# EAGLE design Smarttree_CMU_5.2.3 (EAGLE 7.7.0)

## Sheet 1 of 2
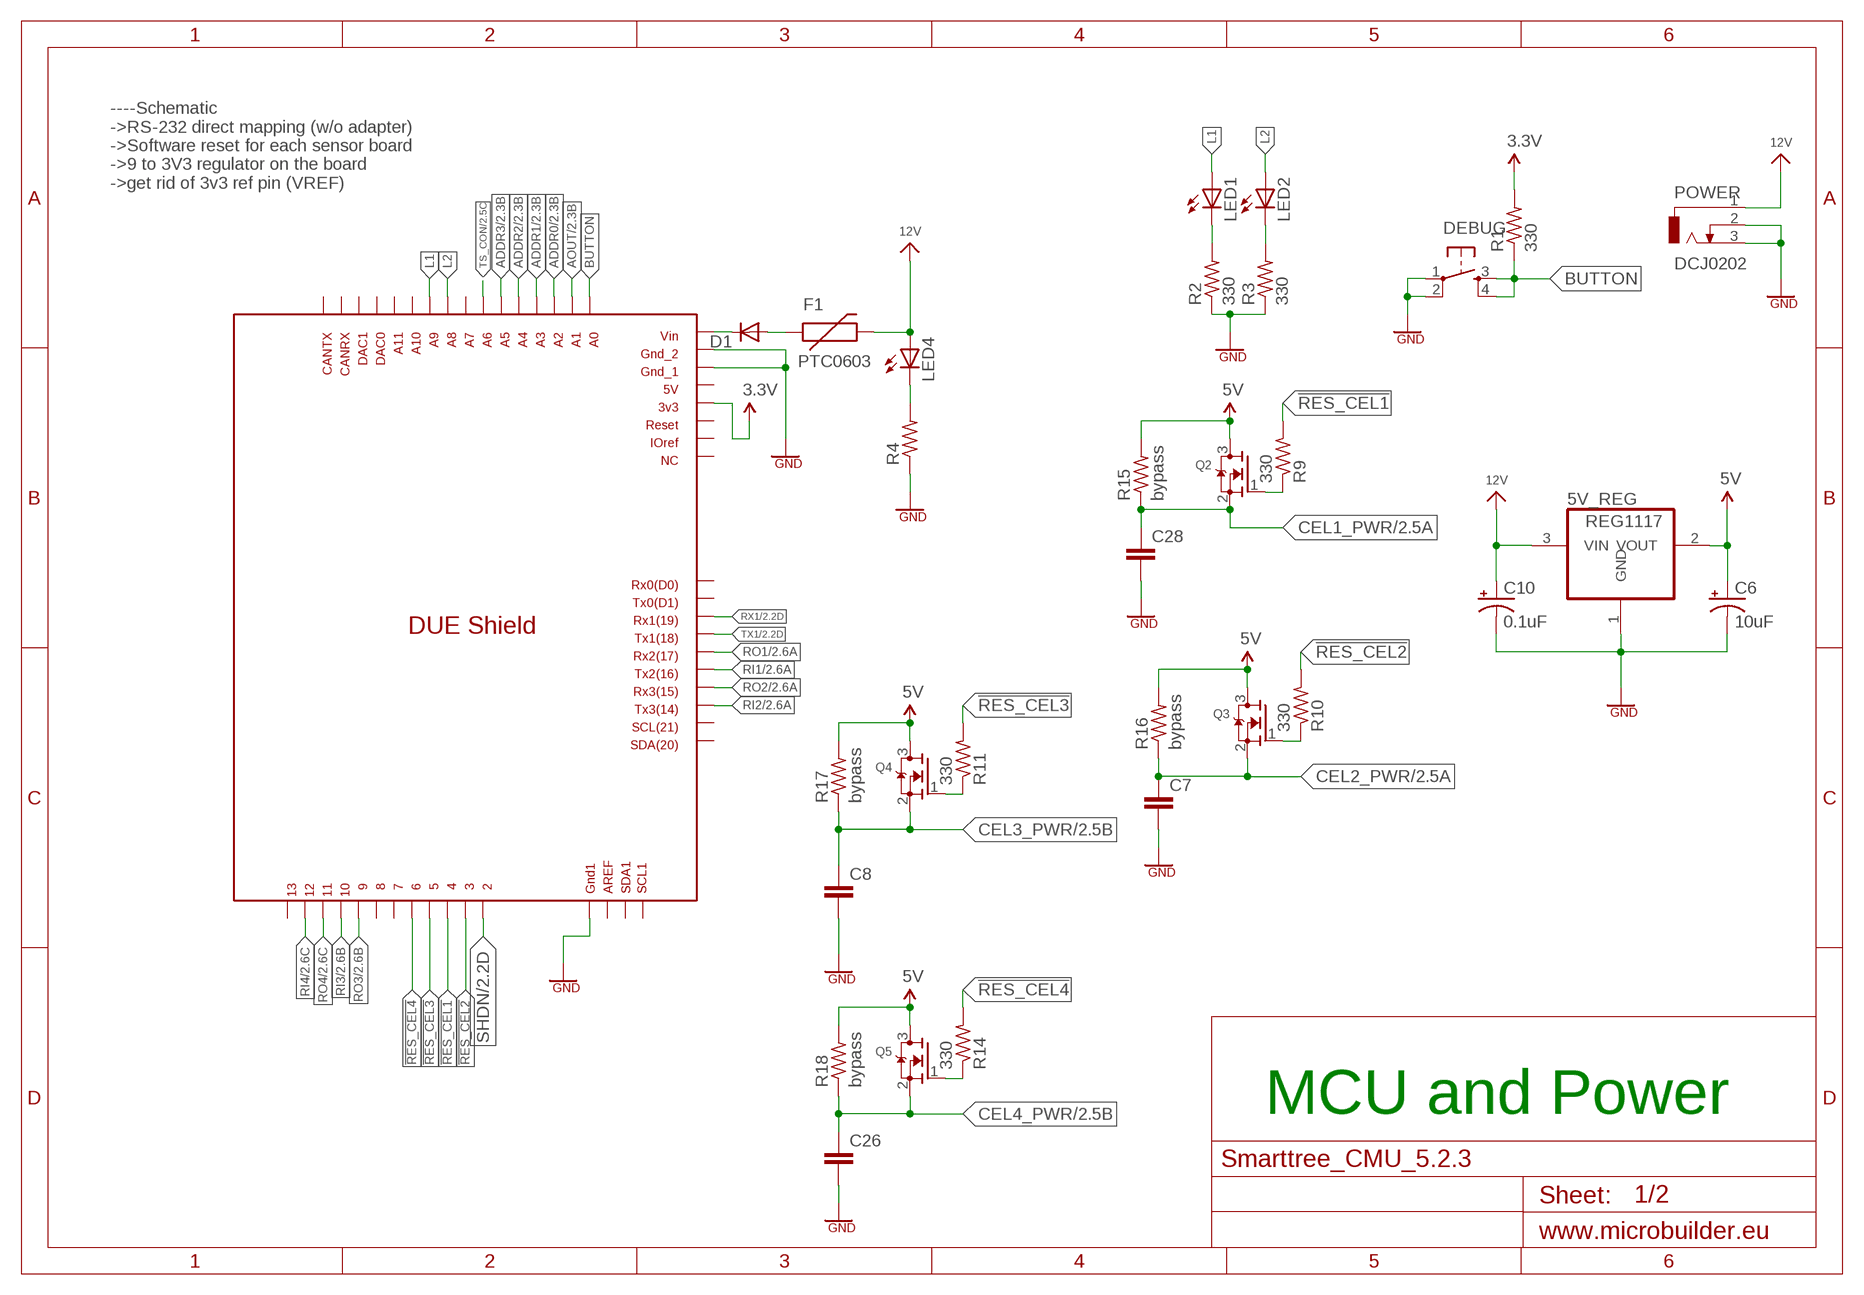
[diagram p0: schematic, sheet 1]

### Parts
5V_REG  REG1117  [SOT223]
C6  10uF  10UF-TANT  [EIA3216]
C7  CAP0603-CAP  [0603-CAP]
C8  CAP0603-CAP  [0603-CAP]
C10  0.1uF  10UF-TANT  [EIA3216]
C26  CAP0603-CAP  [0603-CAP]
C28  CAP0603-CAP  [0603-CAP]
D1  DIODE-SOD106-R  [SOD106-R]
DEBUG  TAC_SWITCHSMD  [TACTILE_SWITCH_SMD]
F1  PTC0603  [0603]
LED1  LED-YELLOW0603  [LED-0603]
LED2  LED-YELLOW0603  [LED-0603]
LED4  LED-YELLOW0603  [LED-0603]
POWER  DCJ0202  [DCJ0202]
Q2  MOSFET-NREFLOW  [SOT23]
Q3  MOSFET-NREFLOW  [SOT23]
Q4  MOSFET-NREFLOW  [SOT23]
Q5  MOSFET-NREFLOW  [SOT23]
R1  330  R-US_M0805  [M0805]
R2  330  R-US_M0805  [M0805]
R3  330  R-US_M0805  [M0805]
R4  R-US_M0805  [M0805]
R9  330  R-US_R0805  [R0805]
R10  330  R-US_R0805  [R0805]
R11  330  R-US_R0805  [R0805]
R14  330  R-US_R0805  [R0805]
R15  bypass  R-US_M0805  [M0805]
R16  bypass  R-US_M0805  [M0805]
R17  bypass  R-US_M0805  [M0805]
R18  bypass  R-US_M0805  [M0805]
U$1  DUE(OUTLINE)  [DUE(NORMAL)]

### Nets
3.3V: R1.2 U$1.3V3 ; also sheet 2
5V: 5V_REG.2(VOUT) C6.A(+) Q2.3(D) Q3.3(D) Q4.3(D) Q5.3(D) R15.2 R16.2 R17.2 R18.2 ; also sheet 2
12V: 5V_REG.3(VIN) C10.A(+) F1.2 LED4.A POWER.1 ; also sheet 2
!RES_CEL1: R9.2 U$1.4
!RES_CEL2: R10.2 U$1.3
!RES_CEL3: R11.2 U$1.5
!RES_CEL4: R14.2 U$1.6
ADDR0: U$1.A2 ; also sheet 2
ADDR1: U$1.A3 ; also sheet 2
ADDR2: U$1.A4 ; also sheet 2
ADDR3: U$1.A5 ; also sheet 2
AOUT: U$1.A1 ; also sheet 2
BUTTON: DEBUG.3 DEBUG.4 R1.1 U$1.A0
CEL1_PWR: C28.1 Q2.2(S) R15.1 ; also sheet 2
CEL2_PWR: C7.1 Q3.2(S) R16.1 ; also sheet 2
CEL3_PWR: C8.1 Q4.2(S) R17.1 ; also sheet 2
CEL4_PWR: C26.1 Q5.2(S) R18.1 ; also sheet 2
GND: 5V_REG.1(GND) C6.C(-) C7.2 C8.2 C10.C(-) C26.2 C28.2 DEBUG.1 DEBUG.2 POWER.2 POWER.3 R2.1 R3.1 R4.1 U$1.GND1 U$1.GND_1 U$1.GND_2 ; also sheet 2
L1: LED1.A U$1.A9
L2: LED2.A U$1.A8
N$3: Q3.1(G) R10.1
N$6: Q2.1(G) R9.1
N$7: Q4.1(G) R11.1
N$9: Q5.1(G) R14.1
N$13: D1.C U$1.VIN
N$57: LED1.C R2.2
N$58: LED2.C R3.2
N$59: LED4.C R4.2
N$69: D1.A F1.1
RI1: U$1.TX2 ; also sheet 2
RI2: U$1.TX3 ; also sheet 2
RI3: U$1.10 ; also sheet 2
RI4: U$1.12 ; also sheet 2
RO1: U$1.RX2 ; also sheet 2
RO2: U$1.RX3 ; also sheet 2
RO3: U$1.9 ; also sheet 2
RO4: U$1.11 ; also sheet 2
RX1: U$1.RX1 ; also sheet 2
SHDN: U$1.2 ; also sheet 2
TS_CON: U$1.A6 ; also sheet 2
TX1: U$1.TX1 ; also sheet 2
Unconnected: U$1.5V U$1.7 U$1.8 U$1.13 U$1.A7 U$1.A10 U$1.A11 U$1.AREF U$1.CANRX U$1.CANTX U$1.DAC0 U$1.DAC1 U$1.IOREF U$1.NC U$1.RESET U$1.RX0 U$1.SCL U$1.SCL1 U$1.SDA U$1.SDA1 U$1.TX0

### Notes on the sheet
- ----Schematic
  ->RS-232 direct mapping (w/o adapter)
  ->Software reset for each sensor board
  ->9 to 3V3 regulator on the board
  ->get rid of 3v3 ref pin (VREF)
- MCU and Power

## Sheet 2 of 2
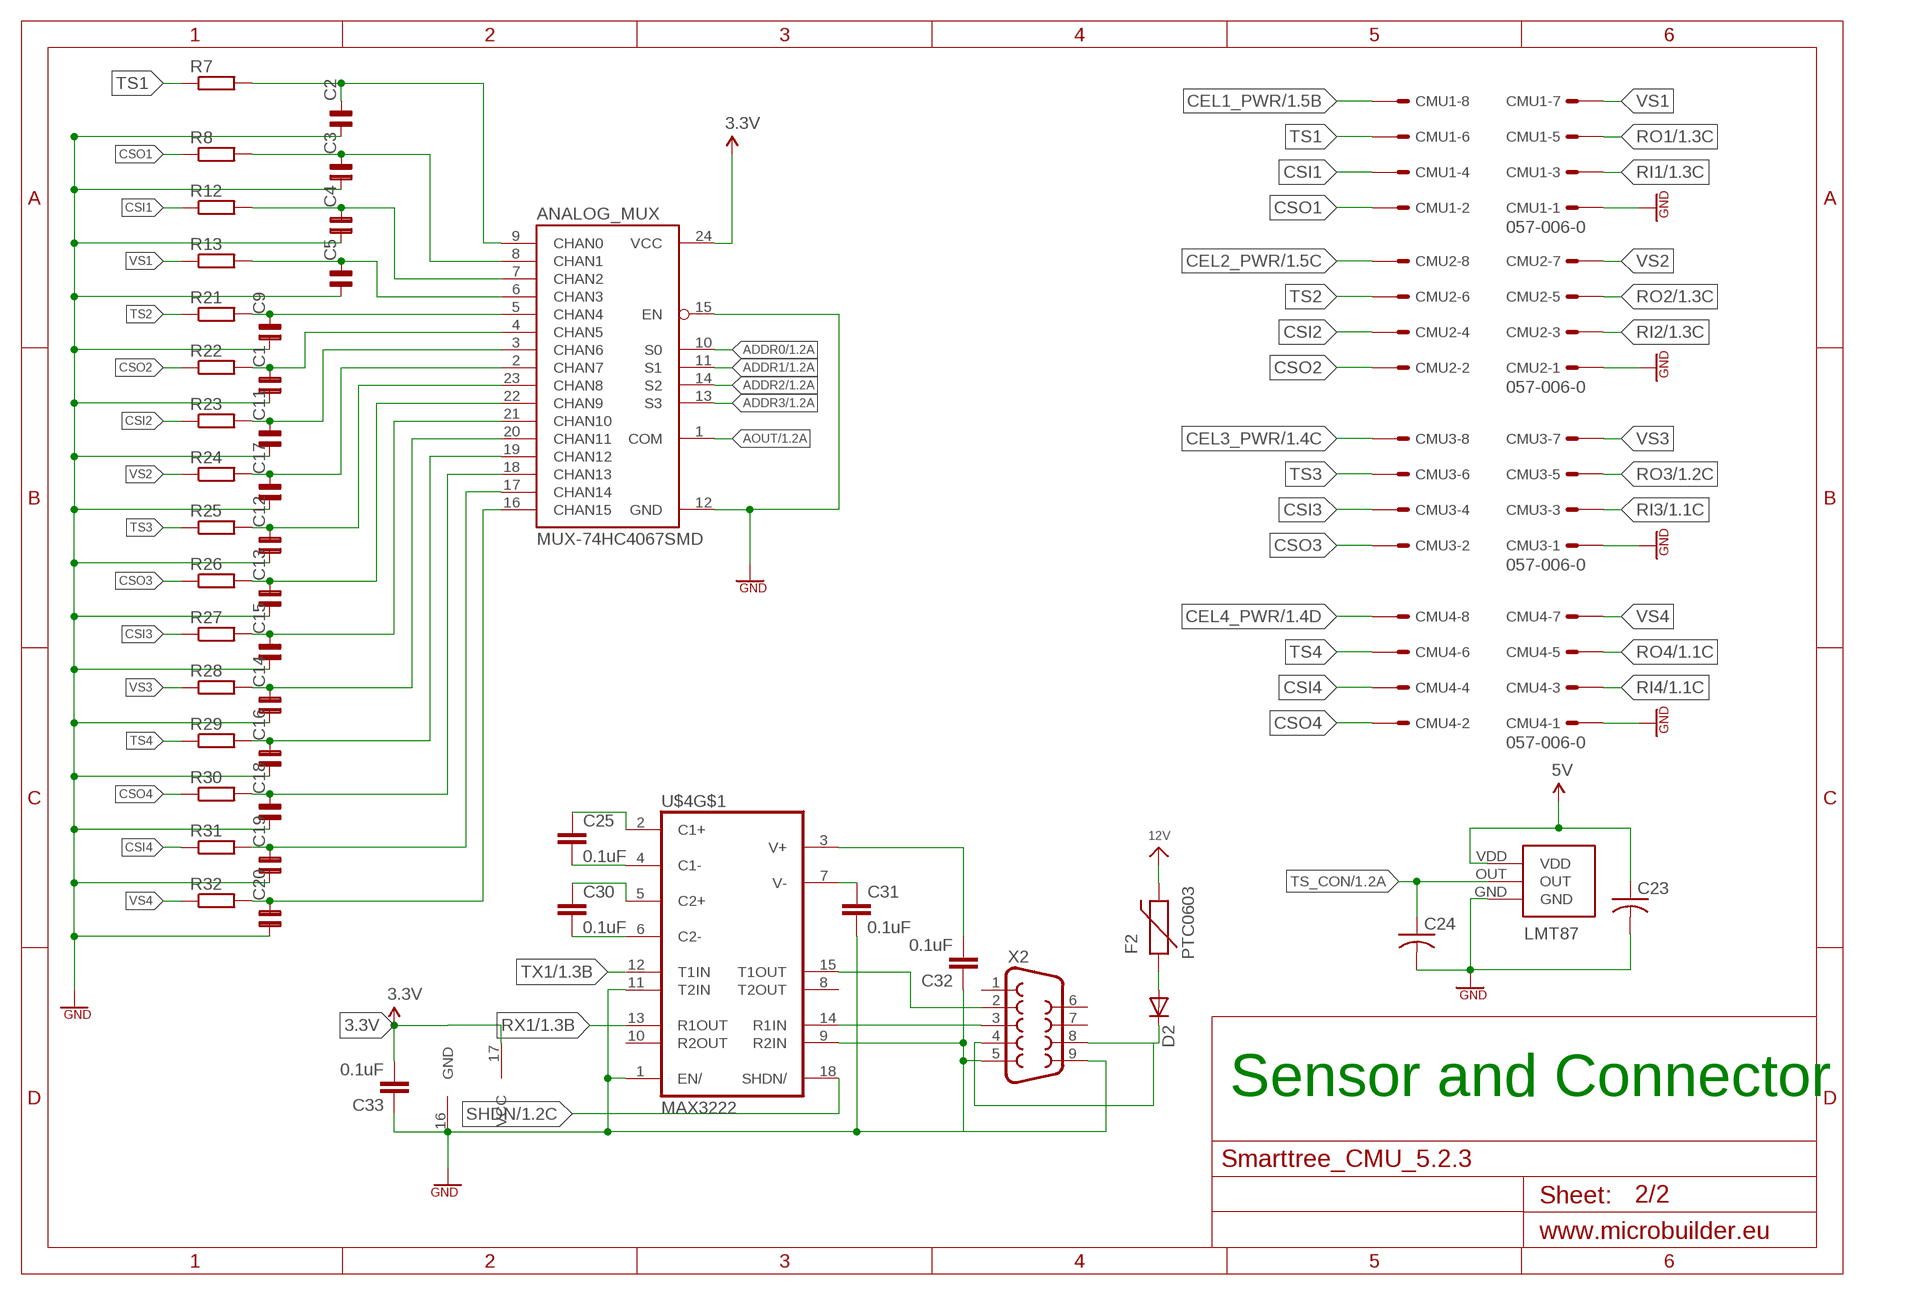
[diagram p1: schematic, sheet 2]

### Parts
ANALOG_MUX  MUX-74HC4067SMD  [SSOP24]
C1  C-NP-SMD-0805  [C-0805]
C2  C-NP-SMD-0805  [C-0805]
C3  C-NP-SMD-0805  [C-0805]
C4  C-NP-SMD-0805  [C-0805]
C5  C-NP-SMD-0805  [C-0805]
C9  C-NP-SMD-0805  [C-0805]
C11  C-NP-SMD-0805  [C-0805]
C12  C-NP-SMD-0805  [C-0805]
C13  C-NP-SMD-0805  [C-0805]
C14  C-NP-SMD-0805  [C-0805]
C15  C-NP-SMD-0805  [C-0805]
C16  C-NP-SMD-0805  [C-0805]
C17  C-NP-SMD-0805  [C-0805]
C18  C-NP-SMD-0805  [C-0805]
C19  C-NP-SMD-0805  [C-0805]
C20  C-NP-SMD-0805  [C-0805]
C23  C-USC0805  [C0805]
C24  C-USC0805  [C0805]
C25  0.1uF  CAP0603-CAP  [0603-CAP]
C30  0.1uF  CAP0603-CAP  [0603-CAP]
C31  0.1uF  CAP0603-CAP  [0603-CAP]
C32  0.1uF  CAP0603-CAP  [0603-CAP]
C33  0.1uF  CAP0603-CAP  [0603-CAP]
CMU1  057-006-0  [057-006-0]
CMU2  057-006-0  [057-006-0]
CMU3  057-006-0  [057-006-0]
CMU4  057-006-0  [057-006-0]
D2  DIODE-SOD106-R  [SOD106-R]
F2  PTC0603  [0603]
LMT87  LMT87_PAC  [LMT87_TO]
R7  R-EU_R0805W  [R0805W]
R8  R-EU_R0805W  [R0805W]
R12  R-EU_R0805W  [R0805W]
R13  R-EU_R0805W  [R0805W]
R21  R-EU_R0805W  [R0805W]
R22  R-EU_R0805W  [R0805W]
R23  R-EU_R0805W  [R0805W]
R24  R-EU_R0805W  [R0805W]
R25  R-EU_R0805W  [R0805W]
R26  R-EU_R0805W  [R0805W]
R27  R-EU_R0805W  [R0805W]
R28  R-EU_R0805W  [R0805W]
R29  R-EU_R0805W  [R0805W]
R30  R-EU_R0805W  [R0805W]
R31  R-EU_R0805W  [R0805W]
R32  R-EU_R0805W  [R0805W]
U$4  MAX3222  [SO18]
X2  DB9MALE  [DB9_MALE]

### Nets
3.3V: ANALOG_MUX.24(VCC) C33.2 U$4.17(VCC) ; also sheet 1
5V: C23.1 LMT87.VDD ; also sheet 1
12V: F2.2 ; also sheet 1
ADDR0: ANALOG_MUX.10(S0) ; also sheet 1
ADDR1: ANALOG_MUX.11(S1) ; also sheet 1
ADDR2: ANALOG_MUX.14(S2) ; also sheet 1
ADDR3: ANALOG_MUX.13(S3) ; also sheet 1
AOUT: ANALOG_MUX.1(COM) ; also sheet 1
CEL1_PWR: CMU1.7 ; also sheet 1
CEL2_PWR: CMU2.7 ; also sheet 1
CEL3_PWR: CMU3.7 ; also sheet 1
CEL4_PWR: CMU4.7 ; also sheet 1
CSI1: CMU1.4 R12.1
CSI2: CMU2.4 R23.1
CSI3: CMU3.4 R27.1
CSI4: CMU4.4 R31.1
CSO1: CMU1.2 R8.1
CSO2: CMU2.2 R22.1
CSO3: CMU3.2 R26.1
CSO4: CMU4.2 R30.1
GND: ANALOG_MUX.12(GND) ANALOG_MUX.15(EN) C1.1 C2.1 C3.1 C4.1 C5.1 C9.1 C11.1 C12.1 C13.1 C14.1 C15.1 C16.1 C17.1 C18.1 C19.1 C20.1 C23.2 C24.2 C31.2 C32.1 C33.1 CMU1.1 CMU2.1 CMU3.1 CMU4.1 LMT87.GND U$4.1(EN/) U$4.9(R2IN) U$4.11(T2IN) U$4.16(GND) X2.5 X2.9 ; also sheet 1
N$2: C31.1 U$4.7(V-)
N$4: D2.C X2.4 X2.8
N$5: D2.A F2.1
N$8: C25.1 U$4.2(C1+)
N$14: C25.2 U$4.4(C1-)
N$15: C30.1 U$4.5(C2+)
N$16: C30.2 U$4.6(C2-)
N$17: ANALOG_MUX.6(CHAN3) C5.2 R13.2
N$18: C32.2 U$4.3(V+)
N$19: ANALOG_MUX.8(CHAN1) C3.2 R8.2
N$20: ANALOG_MUX.7(CHAN2) C4.2 R12.2
N$24: ANALOG_MUX.5(CHAN4) C9.2 R21.2
N$26: ANALOG_MUX.4(CHAN5) C1.2 R22.2
N$28: ANALOG_MUX.3(CHAN6) C11.2 R23.2
N$30: ANALOG_MUX.2(CHAN7) C17.2 R24.2
N$32: ANALOG_MUX.23(CHAN8) C12.2 R25.2
N$34: ANALOG_MUX.22(CHAN9) C13.2 R26.2
N$36: ANALOG_MUX.21(CHAN10) C15.2 R27.2
N$38: ANALOG_MUX.20(CHAN11) C14.2 R28.2
N$39: ANALOG_MUX.19(CHAN12) C16.2 R29.2
N$42: ANALOG_MUX.18(CHAN13) C18.2 R30.2
N$43: ANALOG_MUX.17(CHAN14) C19.2 R31.2
N$46: ANALOG_MUX.16(CHAN15) C20.2 R32.2
RI1: CMU1.3 ; also sheet 1
RI2: CMU2.3 ; also sheet 1
RI3: CMU3.3 ; also sheet 1
RI4: CMU4.3 ; also sheet 1
RO1: CMU1.5 ; also sheet 1
RO2: CMU2.5 ; also sheet 1
RO3: CMU3.5 ; also sheet 1
RO4: CMU4.5 ; also sheet 1
RX: U$4.14(R1IN) X2.3
RX1: U$4.13(R1OUT) ; also sheet 1
SHDN: U$4.18(SHDN/) ; also sheet 1
TS1: CMU1.6 R7.1
TS1OUT: ANALOG_MUX.9(CHAN0) C2.2 R7.2
TS2: CMU2.6 R21.1
TS3: CMU3.6 R25.1
TS4: CMU4.6 R29.1
TS_CON: C24.1 LMT87.OUT ; also sheet 1
TX: U$4.15(T1OUT) X2.2
TX1: U$4.12(T1IN) ; also sheet 1
VS1: CMU1.8 R13.1
VS2: CMU2.8 R24.1
VS3: CMU3.8 R28.1
VS4: CMU4.8 R32.1
Unconnected: U$4.8(T2OUT) U$4.10(R2OUT) X2.1 X2.6 X2.7

### Notes on the sheet
- Sensor and Connector

## Library data of the parts
5V_REG = burr-brown:REG1117: 800mA and 1A Low Dropout (LDO) Positive Regulator 1.8V, 2.5V, 2.85V, 3.3V, 5V, and Adj; MPN: REG1117; OC_FARNELL: 1097566; OC_NEWARK: 14P6981
ANALOG_MUX = SparkFun-AnalogIC:MUX-74HC4067: 16-channel analog MUX; OC_NEWARK: unknown
C1-C5 C9 C11-C20 = cap-pan40:C-NP: NON-POLARIZED FILM/CHIP; OC_NEWARK: unknown
C6 = SparkFun-Retired:10UF-TANT: 10uF Tantalum SMT CAP-00811- 16V 10% (EIA-3216); OC_NEWARK: unknown; PROD_ID: CAP-00811
C7 C8 C25 C26 C28 C30-C33 = SparkFun:CAP: Capacitor Standard 0603 ceramic capacitor, and 0.1" leaded capacitor.
C10 = SparkFun-Retired:10UF-TANT: 10uF Tantalum SMT CAP-00811- 16V 10% (EIA-3216); OC_NEWARK: unknown; PROD_ID: CAP-00811; VALUE: 10uF
C23 C24 = adafruit:C-US: CAPACITOR, American symbol
CMU1-CMU4 = con-panduit:057-006-: CONNECTOR 6-pin series 057 contact pc board low profile headers
D1 D2 = diode:DIODE-: DIODE; OC_NEWARK: unknown
DEBUG = SparkFun-Electromechanical:TAC_SWITCH: Momentary Switch Button commonly used for reset or general input. Spark Fun Electronics SKU : COM-00097 SMT- SWCH-08247; PROD_ID: SWCH-08247
F1 F2 = SparkFun:PTC: Resettable Fuse PTC Resettable Fuse. Spark Fun Electronics SKU : COM-08357
LED1 LED2 LED4 = SparkFun-LED:LED-YELLOW: Yellow SMD LEDs LilyPad 1206- DIO-09909 0603- DIO-09003; PROD_ID: DIO-09003
LMT87 = nick:LMT87_PAC
POWER = con-jack:DCJ0202: DC POWER JACK Source: DCJ0202.pdf; OC_FARNELL: unknown; OC_NEWARK: unknown
Q2-Q5 = adafruit:MOSFET-N: N-Channel Mosfet 2N7002E - 60V 260mA SOT23 [Digikey: 2N7002ET1GOSTR-ND] - REEL BSH103 - 30V 850mA SOT23 [Digikey: 568-5013-1-ND]
R1-R4 R15-R18 = adafruit:R-US_: RESISTOR, American symbol; OC_NEWARK: unknown
R7 R8 R12 R13 R21-R32 = resistor:R-EU_: RESISTOR, European symbol; OC_NEWARK: unknown
R9-R11 R14 = adafruit:R-US_: RESISTOR, American symbol
U$1 = DUElib130425:DUE(OUTLINE)
U$4 = Francis-Project:MAX3222
X2 = SparkFun-Connectors:DB9: DB9 Connector Standard DB9 (D-Sub 9) serial connector. Can be used for CAN bus as well as RS485 and RS232. Footprint production proven. Spark Fun Electronics SKU : PRT-00429; PROD_ID: CONN-09904

## Board
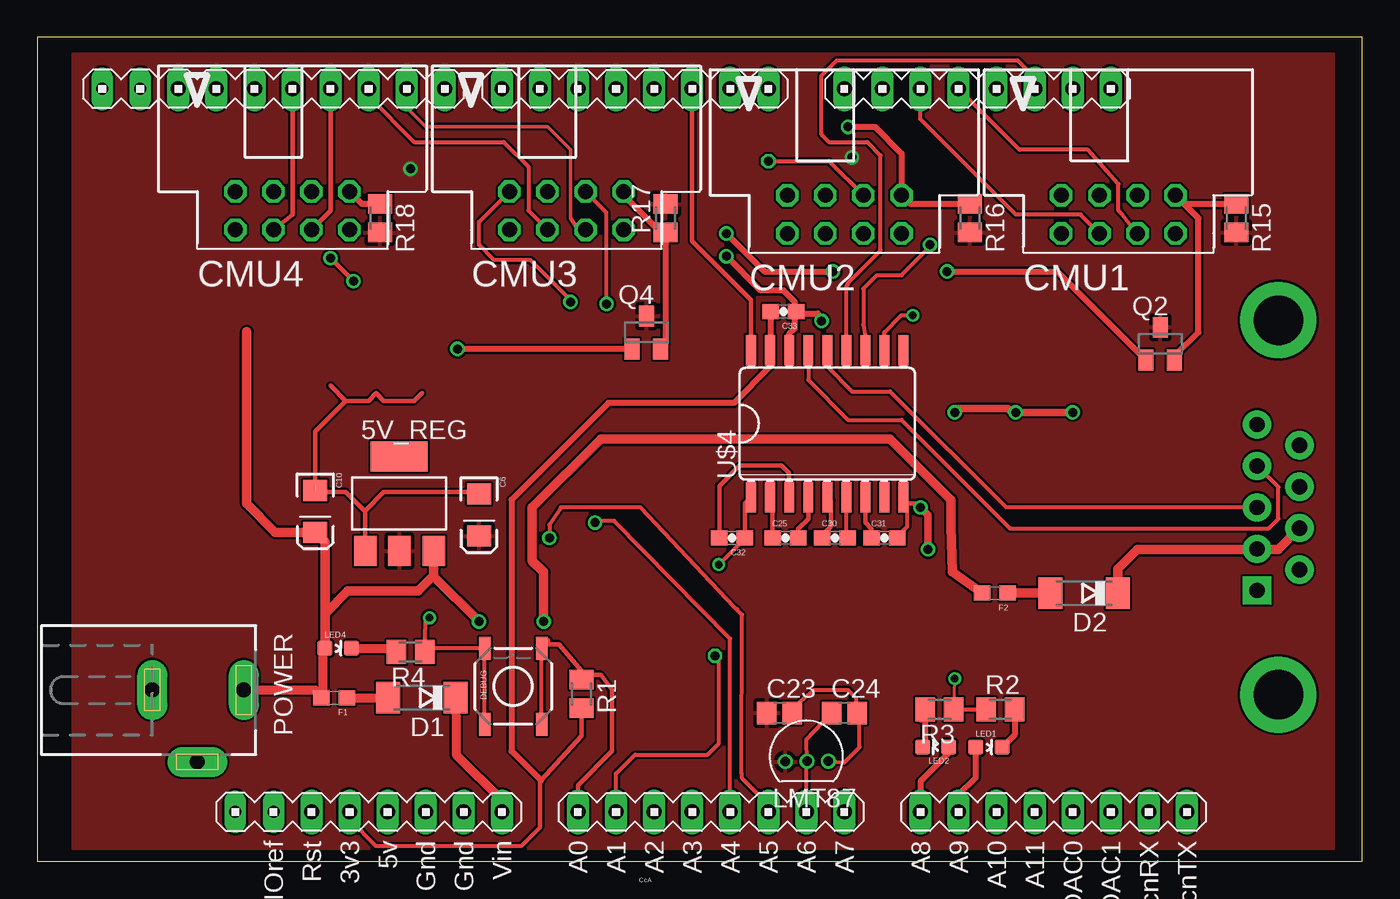
[diagram p2: board, top side]
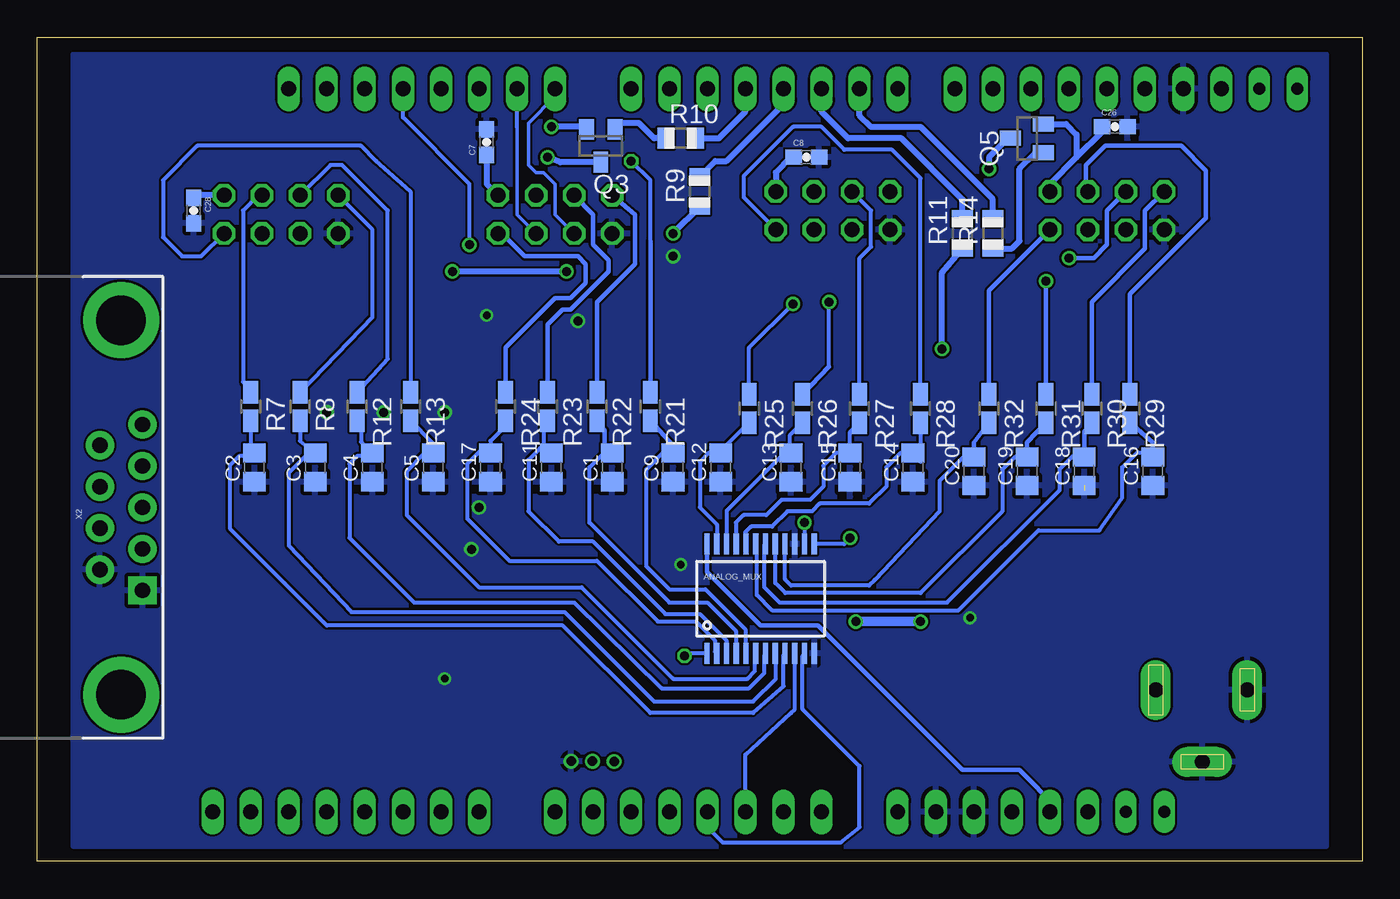
[diagram p3: board, bottom side, seen from below]

Size 88.39 x 54.99 mm. Coordinates in mm from the lower left corner, seen from the top.
Outline: 0,0 88.39,0 88.39,54.99 0,54.99 0,0
Copper layers (1*16): Top 0.0356mm / dielectric 1.5011mm / Bottom 0.0356mm
Design rules "LaenPCBOrder": minimum track width 6mil, minimum drill 13mil, track to track 6mil, track to pad 6mil, pad to pad 6mil, via to via 6mil, smd to smd 6mil, copper to edge 15mil, drill to drill 6mil, minimum pad ring 7mil, minimum via ring 7mil, stop-mask expansion 3mil, vias tented up to drill 0mil, thermal gap 10mil

### Footprints (pad centres in the part's own frame; a part is rotated, then mirrored left to right if it is on the bottom)
SOT223 = smd 1.499 x 2.007: 1 -2.261,-3.15; 2 0.025,-3.15; 3 2.311,-3.15 | smd 3.81 x 2.007: 4 0,3.15
SSOP24 = smd 0.348 x 1.397: 1 -3.575,-3.656; 2 -2.925,-3.656; 3 -2.275,-3.656; 4 -1.625,-3.656; 5 -0.975,-3.656; 6 -0.325,-3.656; 7 0.325,-3.656; 8 0.975,-3.656; 9 1.625,-3.656; 10 2.275,-3.656; 11 2.925,-3.656; 12 3.575,-3.656; 13 3.575,3.656; 14 2.925,3.656; 15 2.275,3.656; 16 1.625,3.656; 17 0.975,3.656; 18 0.325,3.656; 19 -0.325,3.656; 20 -0.975,3.656; 21 -1.625,3.656; 22 -2.275,3.656; 23 -2.925,3.656; 24 -3.575,3.656
C-0805 = smd 1.27 x 1.524: 1 -0.953,0; 2 0.953,0
EIA3216 = smd 1.4 x 1.6: A 1.4,0; C -1.4,0
0603-CAP = smd 1.1 x 1: 1 -0.85,0; 2 0.85,0
C0805 = smd 1.3 x 1.5: 1 -0.85,0; 2 0.85,0
057-006-0 = drill 1 octagon: 1 -2.54,-5.08; 2 -2.54,-2.54; 3 0,-5.08; 4 0,-2.54; 5 2.54,-5.08; 6 2.54,-2.54; 7 5.08,-2.54; 8 5.08,-5.08
SOD106-R = smd 1.6 x 2.1: A 2.25,0; C -2.25,0
TACTILE_SWITCH_SMD = smd 1.524 x 0.762: 1 -2.54,1.905; 2 2.54,1.905; 3 -2.54,-1.905; 4 2.54,-1.905
0603 = smd 1.1 x 1: 1 -0.85,0; 2 0.85,0
LED-0603 = smd 1 x 1: A 0,-0.877; C 0,0.877
LMT87_TO = drill 0.635: GND 0.305,-1.346; OUT 1.727,-1.346; VDD 3.175,-1.321
DCJ0202 = drill 1 pad 2 long: 1 0,3.1; 2 4.8,0; 3 0,-3
SOT23 = smd 1 x 1.4: 1 -0.95,-1.1; 2 0.95,-1.1; 3 0,1.1
M0805 = smd 1.3 x 1.6: 1 -0.95,0; 2 0.95,0
R0805W = smd 1.5 x 1: 1 -0.94,0; 2 0.94,0
R0805 = smd 1.1 x 1.4: 1 -1,0; 2 1,0
DUE(NORMAL) = drill 1 long: 2 -16.51,30.48; 3 -19.05,30.48; 3V3 -39.37,-17.78; 4 -21.59,30.48; 5 -24.13,30.48; 5V -36.83,-17.78; 6 -26.67,30.48; 7 -29.21,30.48; 8 -33.02,30.48; 9 -35.56,30.48; 10 -38.1,30.48; 11 -40.64,30.48; 12 -43.18,30.48; 13 -45.72,30.48; A0 -24.13,-17.78; A1 -21.59,-17.78; A2 -19.05,-17.78; A3 -16.51,-17.78; A4 -13.97,-17.78; A5 -11.43,-17.78; A6 -8.89,-17.78; A7 -6.35,-17.78; A8 -1.27,-17.78; A9 1.27,-17.78; A10 3.81,-17.78; A11 6.35,-17.78; AREF -50.8,30.48; AREF1 -50.8,30.48; CANRX 13.97,-17.78; CANTX 16.51,-17.78; DAC0 8.89,-17.78; DAC1 11.43,-17.78; GND1 -48.26,30.48; GND_1 -34.29,-17.78; GND_2 -31.75,-17.78; RESET -41.91,-17.78; RX0 -11.43,30.48; RX1 6.35,30.48; RX2 1.27,30.48; RX3 -3.81,30.48; SCL 11.43,30.48; SDA 8.89,30.48; TX0 -13.97,30.48; TX1 3.81,30.48; TX2 -1.27,30.48; TX3 -6.35,30.48; VIN -29.21,-17.78 | drill 0.8 pad 1.422 long: IOREF -44.45,-17.78; NC -46.99,-17.78; SCL1 -55.88,30.48; SDA1 -53.34,30.48
SO18 = smd 0.66 x 2.032: 1 -5.08,-4.902; 2 -3.81,-4.902; 3 -2.54,-4.902; 4 -1.27,-4.902; 5 0,-4.902; 6 1.27,-4.902; 7 2.54,-4.902; 8 3.81,-4.902; 9 5.08,-4.902; 10 5.08,4.902; 11 3.81,4.902; 12 2.54,4.902; 13 1.27,4.902; 14 0,4.902; 15 -1.27,4.902; 16 -2.54,4.902; 17 -3.81,4.902; 18 -5.08,4.902
DB9_MALE = drill 1.016 pad 1.88: 1 5.54,-1.42; 2 2.77,-1.42; 3 0,-1.42; 4 -2.77,-1.42; 6 4.15,1.42; 7 1.38,1.42; 8 -1.38,1.42; 9 -4.15,1.42 | drill 1.016 pad 1.88 square: 5 -5.54,-1.42 | drill 3.302 pad 5.08: G1 -12.5,0; G2 12.5,0

### Placement (x,y rotation side)
5V_REG  24.13,23.88 0 top
ANALOG_MUX  40.13,17.53 0 bottom
C1  50.04,26.29 90 bottom
C2  73.91,26.29 90 bottom
C3  69.85,26.29 90 bottom
C4  66.04,26.29 90 bottom
C5  61.98,26.29 90 bottom
C6  29.46,23.11 270 top
C7  58.42,48.01 90 bottom
C8  37.08,46.99 0 bottom
C9  45.97,26.29 90 bottom
C10  18.54,23.37 270 top
C11  54.1,26.29 90 bottom
C12  42.8,26.29 90 bottom
C13  38.1,26.29 90 bottom
C14  29.97,26.29 90 bottom
C15  34.16,26.29 90 bottom
C16  13.97,26.04 90 bottom
C17  58.17,26.29 90 bottom
C18  18.54,26.04 90 bottom
C19  22.35,26.04 90 bottom
C20  25.91,26.04 90 bottom
C23  49.53,9.91 0 top
C24  53.85,9.91 0 top
C25  49.91,21.59 0 top
C26  16.51,49.02 0 bottom
C28  77.98,43.43 270 bottom
C30  53.21,21.59 0 top
C31  56.52,21.59 0 top
C32  46.35,21.59 180 top
C33  49.78,36.7 180 top
CMU1  70.87,46.99 0 top
CMU2  52.58,46.99 0 top
CMU3  34.04,47.24 0 top
CMU4  15.75,47.24 0 top
D1  25.65,10.92 180 top
D2  69.85,17.91 180 top
DEBUG  31.75,11.68 90 top
F1  19.81,10.92 180 top
F2  63.88,17.91 180 top
LED1  63.5,7.62 270 top
LED2  59.94,7.62 90 top
LED4  20.07,14.22 270 top
LMT87  53.09,5.33 180 top
POWER  10.67,11.43 270 top
Q2  74.93,34.54 0 top
Q3  50.8,47.75 180 bottom
Q4  40.64,35.31 0 top
Q5  22.35,48.26 90 bottom
R1  36.32,11.18 270 top
R2  64.26,10.16 0 top
R3  60.2,10.16 180 top
R4  24.89,13.97 180 top
R7  74.17,30.35 270 bottom
R8  70.87,30.35 270 bottom
R9  44.2,44.7 90 bottom
R10  45.47,48.26 0 bottom
R11  26.67,41.91 90 bottom
R12  67.06,30.35 270 bottom
R13  63.5,30.35 270 bottom
R14  24.64,41.91 90 bottom
R15  80.01,42.93 270 top
R16  62.23,42.93 270 top
R17  41.91,42.93 90 top
R18  22.86,42.93 270 top
R21  47.5,30.35 270 bottom
R22  51.05,30.35 270 bottom
R23  54.36,30.35 270 bottom
R24  57.15,30.35 270 bottom
R25  40.89,30.23 270 bottom
R26  37.34,30.23 270 bottom
R27  33.53,30.23 270 bottom
R28  29.46,30.23 270 bottom
R29  15.49,30.23 270 bottom
R30  18.03,30.23 270 bottom
R31  21.08,30.23 270 bottom
R32  24.89,30.23 270 bottom
U$1  60.2,21.08 0 top
U$4  52.7,29.21 0 top
X2  82.8,23.62 90 bottom

### Tracks (layer width: path | path; a pad name or v marks a point on that pad's centre or on a via)
3.3V
  Top 0.254: 33.53,2.29 32.26,1.02 22.61,1.02 20.83,2.79
  Top 0.305: R1.2 36.32,8.38 33.59,5.4 33.53,5.33 33.53,2.29
  Top 0.406: U$1.3V3 20.83,2.79 | 33.59,5.4 31.62,7.37 31.62,24.13 38.1,30.61 46.48,30.61 48.9,33.02 U$4.17 48.93,34.15 C33.2
  Bottom 0.305: ANALOG_MUX.24 43.71,19.32 40.13,15.75 36.32,15.75 26.67,6.1 22.86,6.1 20.32,3.56 20.57,3.56 U$1.3V3
5V  (via drill 0.6)
  Bottom 0.406: Q5.3 23.62,48.26 24.89,46.99 v24.89,46.23 | Q3.3 53.51,46.65 v54.36,46.99
  pour Top: 2.37,53.85 2.37,0.89 86.49,0.89 86.49,53.85
12V  (via drill 0.6)
  Top 0.254: 19.05,11.18 F1.2
  Top 0.305: 19.05,14.09 LED4.A
  Top 0.61: POWER.1 18.54,11.43 F1.2 | 19.05,11.18 19.05,14.09
  Top 0.635: LED4.A 19.19,16.51 | 19.19,16.51 19.19,21.32 C10.A 15.88,21.97 13.97,23.88 13.97,35.36 | 5V_REG.3 26.44,19.07 | 26.44,19.07 25.4,18.03 20.71,18.03 19.19,16.51 | 26.44,19.07 26.44,19.02 v29.46,16 | v33.78,16 33.78,19.3 33.02,20.07 33.02,23.62 37.59,28.19 56.9,28.19 60.96,24.13 60.96,22.35 61.05,19.3 F2.2
  Bottom 0.635: v29.46,16 v33.78,16
!RES_CEL1
  Bottom 0.406: R9.2 43.16,46.74 42.42,46.74 38.61,50.55 U$1.4
!RES_CEL2
  Bottom 0.406: R10.2 42.93,48.26 41.15,50.04 U$1.3
!RES_CEL3
  Bottom 0.406: R11.2 26.65,44.18 30.73,48.26 34.29,48.26 36.07,50.04 U$1.5
!RES_CEL4
  Bottom 0.406: R14.2 24.64,44.2 29.46,49.02 32.77,49.02 33.53,49.78 U$1.6
ADDR0
  Bottom 0.254: U$1.A2 41.15,7.11 38.1,9.91 37.85,10.16 37.85,13.86 ANALOG_MUX.10
ADDR1
  Bottom 0.254: U$1.A3 43.69,2.29 42.67,1.27 34.8,1.27 33.53,2.29 33.53,6.35 37.34,10.16 37.34,13.72 ANALOG_MUX.11
ADDR2  (via drill 0.6)
  Top 0.254: U$1.A4 46.23,14.86 38.48,22.73 37.34,22.73 v37.21,22.61
  Bottom 0.254: v37.21,22.61 ANALOG_MUX.14
ADDR3  (via drill 0.6)
  Top 0.254: 46.71,16.82 46.51,16.96 | U$1.A5 48.26,3.81 48.26,4.32 46.99,5.59 46.99,5.84 47.02,16.45 46.51,16.96 | 46.51,16.96 40.23,23.62 34.92,23.62 34.16,22.48 v34.16,21.59
  Bottom 0.254: v34.16,21.59 34.57,21.18 ANALOG_MUX.13
AOUT  (via drill 0.6)
  Top 0.254: U$1.A1 38.61,5.84 39.88,7.11 44.7,7.11 45.47,7.87 45.47,13.72 v45.21,13.72
  Bottom 0.254: ANALOG_MUX.1 45.06,13.87 v45.21,13.72
BUTTON
  Top 0.254: DEBUG.3 DEBUG.4
  Top 0.305: 36.32,12.45 36.32,12.7 34.8,14.48 33.78,14.48 DEBUG.4 | U$1.A0 36.07,5.08 38.35,7.37 38.35,11.43 37.59,12.45 36.32,12.45 | 36.32,12.45 R1.1
  Top 0.406: 34.04,14.73 DEBUG.4
CEL1_PWR
  Top 0.406: Q2.2 75.88,33.72 77.47,35.31 77.47,42.93 CMU1.7 76.52,43.88 R15.1
  Bottom 0.406: CMU1.7 77.81,44.45 C28.1
CEL2_PWR  (via drill 0.6)
  Top 0.406: v54.1,49.02 55.88,49.02 57.66,47.24 CMU2.7 58.23,43.88 R16.1
  Bottom 0.406: Q3.2 51.92,49.02 v54.1,49.02 | C7.1 58.42,45.21 CMU2.7
CEL3_PWR
  Top 0.406: CMU3.7 39.12,44.45 41.91,41.66 | 41.91,41.66 41.91,34.53 Q4.2 | R17.1 41.91,41.66
  Bottom 0.406: C8.1 38.1,46.99 39.12,45.97 CMU3.7
CEL4_PWR
  Top 0.406: R18.1 21.66,43.88 CMU4.7
  Bottom 0.406: Q5.2 19.75,49.21 19.05,48.51 19.05,46.99 | 19.05,46.99 20.83,45.21 CMU4.7 | C26.1 17.36,48.68 19.05,46.99
CSI1
  Bottom 0.254: CMU1.4 68.83,46.48 68.07,46.48 65.02,43.43 65.02,33.53 R12.1
CSI2
  Bottom 0.305: R23.1 54.36,35.81 53.34,36.83 52.83,36.83 50.29,39.37 50.29,40.13 51.31,41.15 51.31,43.18 CMU2.4
CSI3
  Bottom 0.254: R27.1 33.53,40.26 32.77,41.02 32.77,43.43 CMU3.4
CSI4  (via drill 0.6)
  Top 0.305: v21.08,38.73 v19.56,40.26
  Bottom 0.305: R31.1 v21.08,38.73 | v19.56,40.26 17.91,40.26 17.02,41.15 17.02,43.43 CMU4.4
CSO1
  Bottom 0.254: CMU1.2 66.04,42.16 66.04,36.32 R8.1
CSO2
  Bottom 0.305: R22.1 51.05,37.34 48.51,39.88 48.51,43.18 CMU2.2
CSO3  (via drill 0.6)
  Top 0.254: v35.56,37.34 35.56,37.47 32.89,40.13 30.48,40.13 29.46,41.15 29.46,42.67 CMU3.2
  Bottom 0.254: 35.56,33.02 v35.56,37.34
  Bottom 0.305: R26.1 35.56,33.02
CSO4
  Bottom 0.305: R30.1 18.03,37.34 14.48,40.89 14.48,43.43 CMU4.2
GND  (via drill 0.5, 0.6)  (1 unrouted)
  Top 0.203: R3.1 v61.21,12.19
  Top 0.254: DEBUG.1 DEBUG.2 26.16,14.22 | R4.1 25.91,16 v26.16,16.26 | LMT87.GND 53.85,6.6 54.86,7.62 54.86,9.4 | 54.86,9.4 C24.2 | C23.2 50.29,10.16 51.82,11.43 54.1,11.43 54.61,10.92 54.61,9.65 54.86,9.4 | 57.28,21.59 C31.2 57.78,21.59 57.78,22.1 58.04,22.35 58.04,23.88 U$4.9 | R3.1 R2.1 | U$4.11 56.52,35.31 57.66,36.45 v58.42,36.45 | 47.2,23.89 47.2,21.55 v45.47,19.81
  Top 0.305: 19.56,31.75 20.57,30.73 | 25.65,31.24 25.15,30.73 23.11,30.73 22.61,31.24 22.1,30.73 20.57,30.73 | 20.57,30.73 18.54,28.7 C10.C 18.67,24.64 20.57,24.64 21.87,23.34 | 5V_REG.1 21.87,23.34 | 21.87,23.34 21.87,23.39 23.11,24.64 29.34,24.64 C6.C | C32.1 47.2,23.89 U$4.1 | v58.93,23.62 58.67,23.88 58.04,23.88
  Top 0.406: 26.16,14.22 R4.1 | U$4.16 50.16,35.18 50.55,35.56 50.55,36.58 | 50.55,36.58 50.55,36.62 | 50.55,36.62 C33.1 50.76,36.58 | 50.76,36.58 52.07,36.58 52.07,36.32 v52.32,36.07 52.32,36.32 | 50.76,36.58 50.55,36.58 | 50.55,36.62 50.55,37.34 49.78,38.1 48.26,38.1 v45.97,40.39
  Top 0.508: v58.93,23.62 59.44,23.11 v59.44,20.83 | v69.09,29.97 65.02,29.97 64.77,30.23 61.47,30.23 v61.21,29.97
  other vias: 65.28,29.97
  pour Bottom: 2.41,53.85 2.41,1.02 85.98,1.02 85.98,53.85
L1
  Top 0.406: U$1.A9 61.47,4.45 62.61,5.59 62.61,7.61 LED1.A
L2
  Top 0.406: LED2.A 60.82,7.23 58.93,5.33 U$1.A8
N$2
  Top 0.305: C31.1 55.66,22.19 55.24,22.61 U$4.7
N$3
  Bottom 0.406: R10.1 47.24,48.26 48.26,49.28 49.68,49.28 Q3.1
N$4
  Top 0.635: D2.C 72.1,19.52 73.41,20.83 81.36,20.83 X2.4 81.41,20.83 82.8,20.83 X2.8
N$5
  Top 0.635: D2.A F2.1
N$6  (via drill 0.6)
  Top 0.406: v45.97,41.91 48.51,39.37 v53.09,39.37 | v60.71,39.37 68.05,39.37 Q2.1
  Bottom 0.406: R9.1 45.97,41.93 v45.97,41.91 | v53.09,39.37 v60.71,39.37
N$7  (via drill 0.6)
  Top 0.406: Q4.1 v28.02,34.21
  Bottom 0.406: v28.02,34.21 28.02,39.3 R11.1
N$8
  Top 0.305: C25.1 49.06,24.14 U$4.2
N$9
  Bottom 0.406: R14.1 23.35,40.91 22.86,41.4 22.86,46.23 21.84,47.24 21.32,47.24 Q5.1
N$13
  Top 0.61: D1.C 27.94,8.64 27.94,7.11 30.99,4.06 U$1.VIN
N$14
  Top 0.305: C25.2 50.76,22.19 51.44,22.86 U$4.4
N$15
  Top 0.305: C30.1 52.36,21.76 52.96,22.35 52.96,24.05 U$4.5
N$16
  Top 0.254: C30.2 53.98,21.59 U$4.6
N$17
  Bottom 0.254: ANALOG_MUX.6 40.51,13.72 40.51,12.7 41.02,12.19 45.97,12.19 52.07,18.29 58.93,18.29 63.75,23.11 63.75,26.04 62.55,27.24 C5.2 61.98,27.89 R13.2
N$18
  Top 0.305: C32.2 45.51,25.06 46.86,26.42 49.66,26.42 50.16,25.91 U$4.3
N$19
  Bottom 0.254: R8.2 70.87,28.07 C3.2 70.29,27.24 71.63,25.91 71.63,21.08 67.44,16.64 53.21,16.64 47.24,10.67 40.64,10.67 39.12,12.19 39.12,13.83 ANALOG_MUX.8
N$20
  Bottom 0.254: ANALOG_MUX.7 39.88,13.72 39.88,12.57 40.89,11.56 46.74,11.56 52.58,17.27 63.25,17.27 67.56,21.59 67.56,26.54 67.06,27.05 66.23,27.05 C4.2 66.8,28 66.8,29.16 R12.2
N$24
  Bottom 0.254: ANALOG_MUX.5 41.15,13.91 41.15,15.49 43.81,18.16 46.23,18.16 47.75,19.68 47.75,26.16 46.67,27.24 C9.2
  Bottom 0.305: C9.2 45.97,27.76 R21.2
N$26
  Bottom 0.254: C1.2 50.04,27.3 50.55,27.3 51.56,26.29 51.56,22.61 46.23,17.27 43.69,17.27 41.78,15.37 41.78,13.9 ANALOG_MUX.4
  Bottom 0.305: 50.55,27.3 50.55,28.78 R22.2
N$28
  Bottom 0.254: R23.2 54.61,28.96 54.61,27.56 | 54.61,27.56 54.1,27.56 C11.2 | ANALOG_MUX.3 42.42,13.88 42.42,14.73 44.2,16.51 46.48,16.51 51.31,21.34 53.59,21.34 55.63,23.37 55.63,26.8 54.86,27.56 54.61,27.56
N$30
  Bottom 0.254: R24.2 57.4,28.96 57.4,28.83 58.17,28.07 C17.2 58.17,27.56 58.67,27.56 59.69,26.54 59.69,22.86 56.9,20.07 51.05,20.07 46.99,16 44.45,16 43.18,14.73 43.18,13.99 ANALOG_MUX.2
N$32
  Bottom 0.254: R25.2 42.8,27.38 C12.2 43.62,27.24 44.2,26.67 44.2,23.62 43.05,22.48 ANALOG_MUX.23
N$34
  Bottom 0.254: ANALOG_MUX.22 42.41,23.38 38.86,26.92 38.42,26.92 C13.2 38.16,27.3 38.16,28.46 R26.2
N$36
  Bottom 0.254: ANALOG_MUX.21 41.78,21.21 41.78,22.61 41.27,23.11 39.75,23.11 38.73,24.13 36.83,24.13 35.94,25.02 35.94,26.42 35.12,27.24 C15.2 34.16,28.65 R27.2
N$38
  Bottom 0.254: 29.46,26.67 C14.2 | R28.2 29.46,27.75 C14.2 | C14.2 30.8,27.24 31.75,26.29 31.75,25.02 32.89,23.88 36.2,23.88 36.7,23.37 38.35,23.37 39.37,22.35 40.77,22.35 41.15,21.97 41.15,21.22 ANALOG_MUX.20
N$39
  Bottom 0.254: C16.2 14.22,27.3 14.99,27.3 16,26.29 16,24.26 17.53,22.1 21.59,22.1 26.92,16.76 39.37,16.76 40.39,17.78 40.39,21.11 ANALOG_MUX.19
  Bottom 0.305: C16.2 13.97,27.94 R29.2
N$42
  Bottom 0.254: C18.2 18.54,27.3 19.05,27.3 19.05,27.05 19.3,27.05 20.19,26.16 20.19,24.77 27.69,17.27 38.86,17.27 39.88,18.29 39.88,21.11 ANALOG_MUX.18
  Bottom 0.305: 18.54,27.3 18.54,28.7 R30.2
N$43
  Bottom 0.254: ANALOG_MUX.17 39.16,18.58 38.48,17.91 29.46,17.91 24,23.37 24,26.16 23.18,26.99 C19.2
  Bottom 0.305: R31.2 22.35,27.94 C19.2
N$46
  Bottom 0.254: ANALOG_MUX.16 38.51,18.82 38.1,18.41 32.89,18.41 32.51,18.8 28.19,23.37 28.19,25.4 26.54,27.05 25.97,27.05 C20.2
  Bottom 0.305: R32.2 25.91,27.94 C20.2
N$57
  Top 0.254: 65.02,8.13 LED1.C
  Top 0.406: R2.2 65.21,8.46 LED1.C
N$58
  Top 0.254: 58.93,9.4 R3.2
  Top 0.406: LED2.C 59.25,7.62 R3.2
N$59
  Top 0.406: 23.88,14.22 R4.2
  Top 0.61: LED4.C 23.88,14.22
N$69
  Top 0.508: 23.37,10.92 D1.A
  Top 0.61: F1.1 23.37,10.92
RI1
  Top 0.254: CMU1.3 69.6,43.18 65.28,43.18 58.93,49.53 U$1.TX2
RI2
  Bottom 0.229: CMU2.3 53.85,43.18 53.85,45.21 54.61,45.97 55.12,45.97 55.63,46.48 55.63,49.28 53.85,51.05 U$1.TX3
RI3
  Top 0.254: U$1.10 22.1,51.05 25.15,48.01 31.11,48.01 32.77,46.35 32.77,43.43 CMU3.3
RI4
  Top 0.229: 17.02,51.05 U$1.12
  Top 0.305: CMU4.3 17.02,43.18 17.02,51.05
RO1
  Top 0.254: CMU1.5 72.39,43.18 72.14,43.43 72.14,45.21 70.1,47.5 65.53,47.5 U$1.RX2
RO2
  Bottom 0.229: CMU2.5 56.39,43.18 56.39,49.02
  Bottom 0.254: 56.39,49.02 U$1.RX3
RO3
  Top 0.229: CMU3.5 36.07,42.16 35.56,42.93 35.56,47.5 34.04,49.02 25.91,49.02 24.64,50.29 U$1.9
RO4
  Top 0.305: U$1.11 19.56,43.43 CMU4.5
RX
  Top 0.254: U$4.14 52.7,33.02 54.36,31.37 56.9,31.37 64.64,23.62 X2.3
RX1
  Top 0.254: U$4.13 53.98,38.35 54.1,38.61 56.26,40.77 56.26,47.12 55.37,48.01 52.83,48.01 52.32,48.51 52.32,52.45 53.34,53.47 65.41,53.47 66.55,52.32 U$1.RX1
SHDN
  Top 0.305: U$1.2 43.69,41.4 47.62,37.47 U$4.18
TS1
  Bottom 0.254: CMU1.6 73.66,44.45 74.68,43.43 74.68,32 R7.1
TS1OUT
  Bottom 0.254: R7.2 74.17,27.3 C2.2 73.91,27.05 74.93,27.05 75.56,26.42 75.56,22.23 69.09,15.75 53.34,15.75 47.5,9.91 40.64,9.91 38.61,11.68 38.61,13.77 ANALOG_MUX.9
TS2  (via drill 0.6)
  Top 0.254: v48.77,46.74 52.83,46.74 CMU2.6
  Bottom 0.254: 47.5,41.4 47.5,45.47 v48.77,46.74
  Bottom 0.305: R21.1 47.5,41.4
TS3  (via drill 0.6)
  Top 0.254: v37.97,37.21 37.97,43.31 CMU3.6
  Bottom 0.254: R25.1 40.89,34.29 v37.97,37.21
TS4
  Bottom 0.305: R29.1 15.49,37.85 10.41,42.93 10.41,46.1 12.06,47.75 17.14,47.75 18.41,46.48 18.41,44.83 CMU4.6
TS_CON
  Top 0.254: U$1.A6 51.31,6.6 LMT87.OUT 51.31,8.13 C24.1
TX
  Top 0.254: U$4.15 51.44,32.13 54.1,29.46 57.66,29.46 64.9,22.23 82.17,22.23 82.8,22.86 82.8,24.97 X2.2
TX1  (via drill 0.6)
  Top 0.254: 55.24,34.04 U$4.12 55.24,34.92 55.12,35.81 55.12,38.23 56.01,39.12 57.66,39.12 59.56,41.02 v59.56,41.15
  Bottom 0.254: v59.56,41.15 59.56,45.21 64.01,49.66 U$1.TX1
VS1
  Bottom 0.254: R13.1 63.5,44.7 65.79,46.74 66.8,47.75 77.72,47.75 80.01,45.47 80.01,41.66 78.74,40.39 77.47,40.39 CMU1.8
VS2
  Bottom 0.305: CMU2.8 57.15,41.66 55.88,40.39 52.32,40.39 51.82,39.88 51.82,38.61 52.83,37.59 53.85,37.59 57.15,34.29 R24.1
VS3
  Bottom 0.254: R28.1 29.46,45.59 31.37,47.5 34.54,47.5 36.07,49.02 37.97,49.02 41.27,45.72 41.27,44.32 CMU3.8
VS4
  Bottom 0.305: R32.1 24.89,38.1 CMU4.8

### Text on the board
tPlace: CcA
tDocu: ----Layout / ->make it nicer / ->put analog MUX on the top layer / ->make a debugging interface for sensor reading / ->switch bypass with jumper / ->make sensor board connectors closer to the edge